# Altium schematic sheet 宁波2号线PIS_数字功率放大器_功放板(BHC-A-2030-01)_原理图_V1.0 (16).SchDoc
size 594 x 419 mm; SheetNumber: 0; SheetTotal: 0; PageSetup: Record=PageOptions|CenterHorizontal=True|CenterVertical=True|PrintScale=0.68|XCorrection=1.00|YCorrection=1.00|PrintKind=0|BorderSize=5000000|LeftOffset=0|BottomOffset=0|Orientation=2|PaperLength=4200|PaperWidth=2970|Scale=100|PaperSource=7|PrintQuality=-4|MediaType=1|DitherType=10|PaperKind=A3 297 x 420 毫米¦PrintScaleMode=1
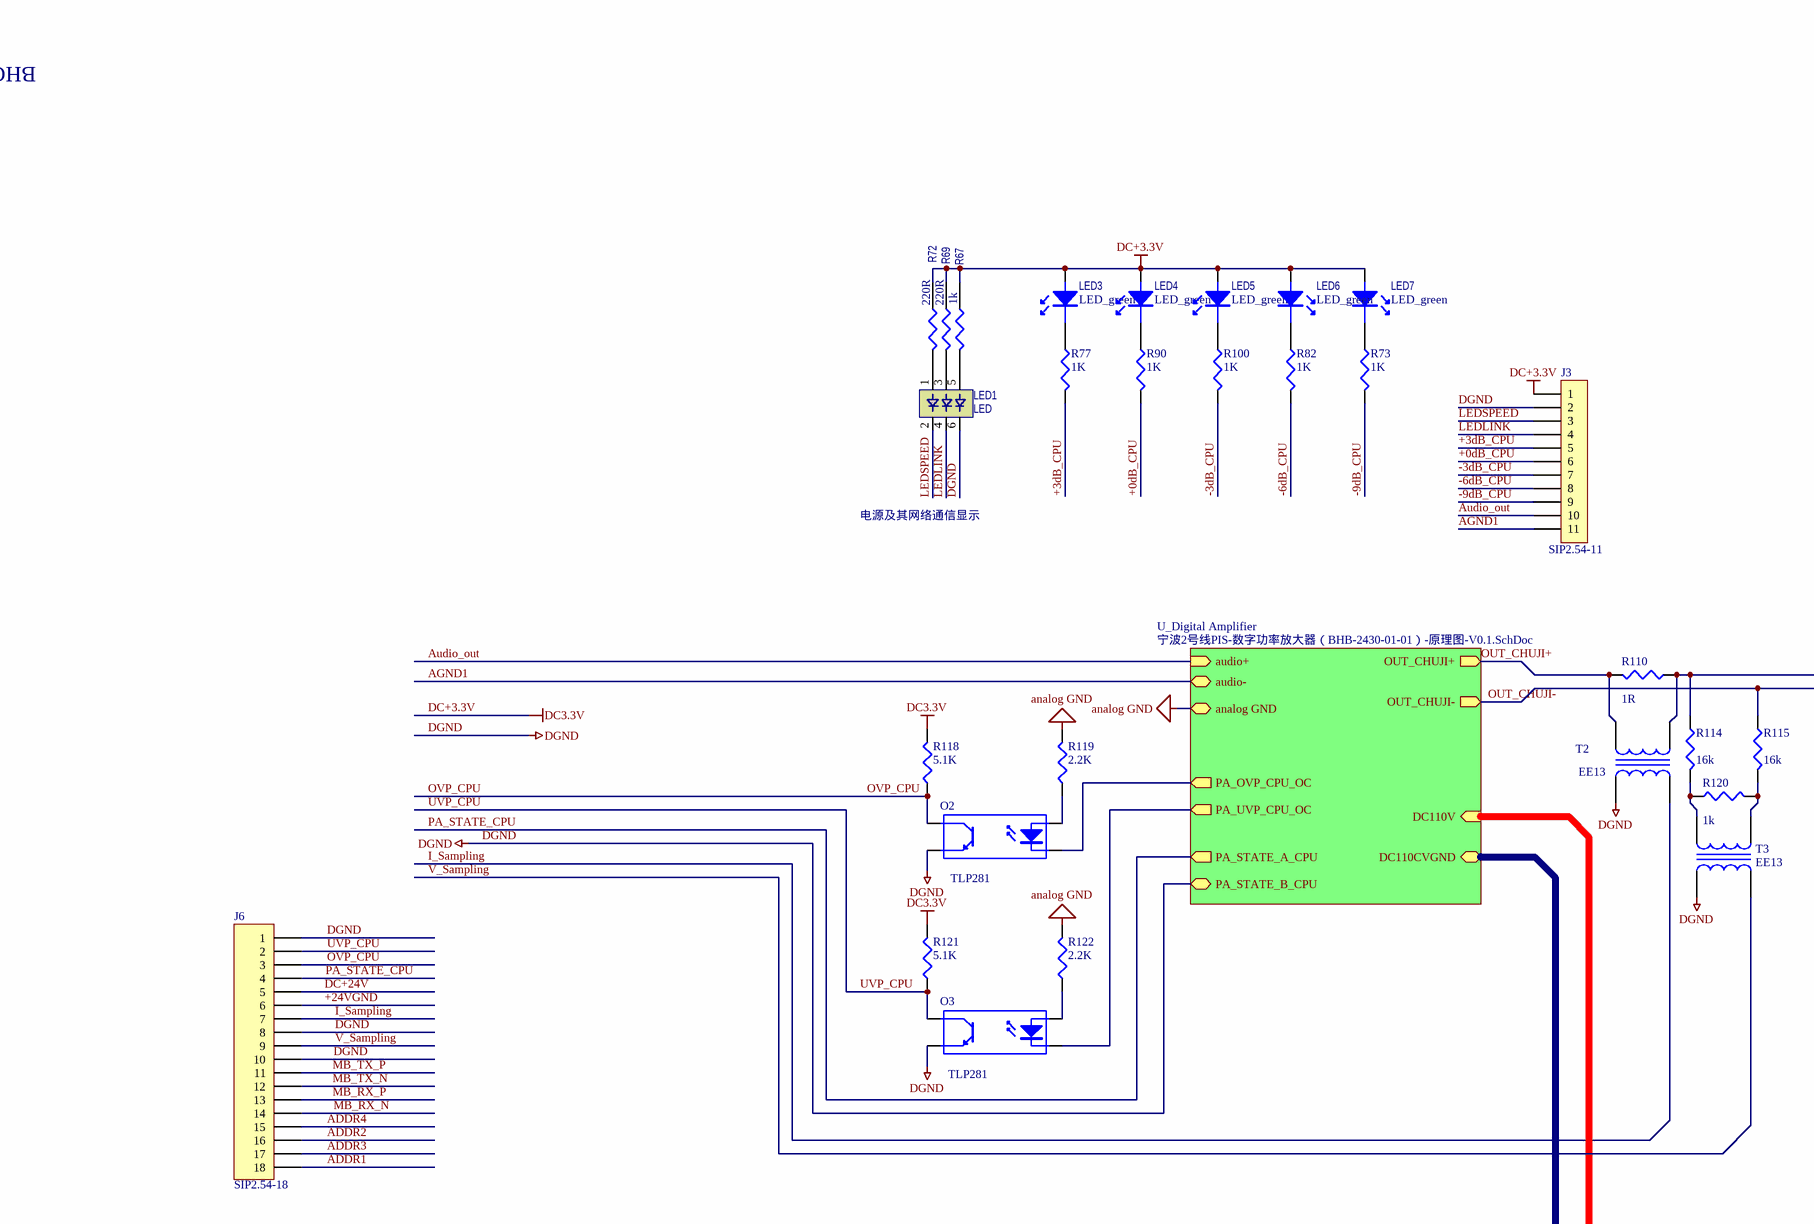
[diagram p0: 宁波2号线PIS_数字功率放大器_功放板(BHC-A-2030-01)_原理图_V1.0 (16).SchDoc, top left]
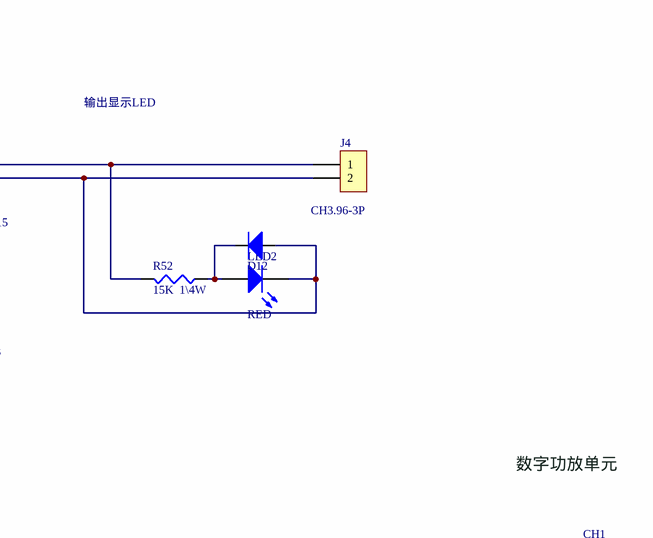
[diagram p1: 宁波2号线PIS_数字功率放大器_功放板(BHC-A-2030-01)_原理图_V1.0 (16).SchDoc, top right]
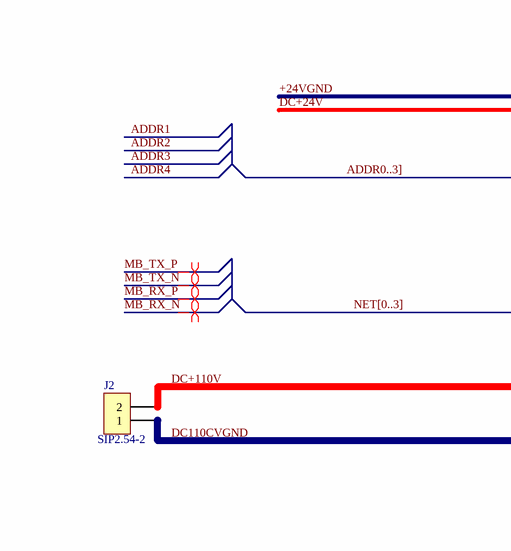
[diagram p2: 宁波2号线PIS_数字功率放大器_功放板(BHC-A-2030-01)_原理图_V1.0 (16).SchDoc, bottom left]
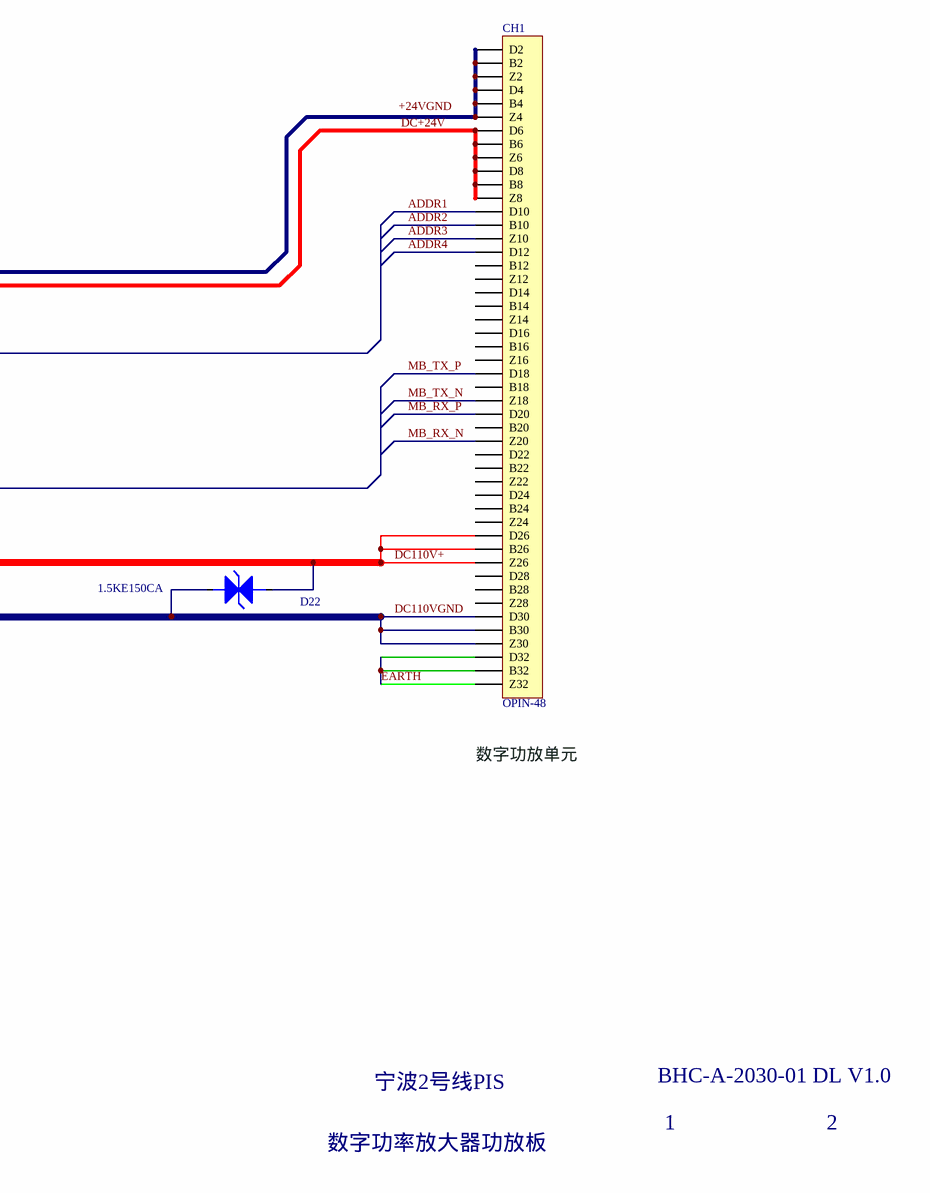
[diagram p3: 宁波2号线PIS_数字功率放大器_功放板(BHC-A-2030-01)_原理图_V1.0 (16).SchDoc, bottom right]

## Parts
CH1  OPIN-48  [OPIN-48f]
D12  DIODE  [7227AK]  (value not drawn)
D22  value 1.5KE150CA  [TVS-CA]  (hidden comment: D_TVS)
J2  value SIP2.54-2  [SIP2.54-2]  (hidden comment: CON2)
J3  value SIP2.54-11  [SIP2.54-11]  (hidden comment: CON11)
J4  value CH3.96-3P  [CH3.96-3P+]  (hidden comment: CON2)
J6  value SIP2.54-18  [SIP2.54-18]  (hidden comment: CON18)
LED1  LED  [LED-3-3-L]
LED2  RED  [LED-3-L]
LED3  value LED_green  [LED-3-L]
LED4  value LED_green  [LED-3-L]
LED5  value LED_green  [LED-3-L]
LED6  value LED_green  [LED-3-L]
LED7  value LED_green  [LED-3-L]
O2  TLP281  [SOP4]
O3  TLP281  [SOP4]
R52  value 15K  1\4W  [R-1/4W]
R67  value 1k  [M0805]
R69  value 220R  [M0805]
R72  value 220R  [M0805]
R73  value 1K  [M0805]  (hidden comment: 11k)
R77  value 1K  [M0805]  (hidden comment: 11k)
R82  value 1K  [M0805]  (hidden comment: 11k)
R90  value 1K  [M0805]  (hidden comment: 11k)
R100  value 1K  [M0805]  (hidden comment: 11k)
R110  value 1R  [R-2W]
R114  value 16k  [R-1/4W]
R115  value 16k  [R-1/4W]
R118  value 5.1K  [M0805]
R119  value 2.2K  [M0805]
R120  value 1k  [R-1/4W]
R121  value 5.1K  [M0805]
R122  value 2.2K  [M0805]
T2  EE13  [EE13-C]
T3  EE13  [EE13-C]

## Sub-sheets
U_Digital Amplifier = 宁波2号线PIS-数字功率放大器（BHB-2430-01-01）-原理图-V0.1.SchDoc: audio+ (in), OUT_CHUJI+ (out), OUT_CHUJI- (out), PA_STATE_A_CPU (out), PA_UVP_CPU_OC (out), PA_OVP_CPU_OC (out), DC110V (in), DC110CVGND (bidir), PA_STATE_B_CPU (bidir), audio- (bidir), analog GND (bidir)

## Nets
analog GND: R119.1 R122.1 ; sheet U_Digital Amplifier/analog GND
DC+3.3V: J3.1 LED3.1 LED4.1 LED5.1 LED6.1 LED7.1 R67.2 R69.2 R72.2 R118.1 R121.1  [also labelled DC3.3V]
DGND: J3.2 J6.1 J6.8 J6.10 LED1.6 O2.3(E) O3.3(E) T2.1 T3.1 ; sheet U_Digital Amplifier/PA_STATE_B_CPU
+0dB_CPU: J3.6 R90.2
+3dB_CPU: J3.5 R77.2
+24VGND: CH1.B2 CH1.B4 CH1.D2 CH1.D4 CH1.Z2 CH1.Z4 J6.6
-3dB_CPU: J3.7 R100.2
-6dB_CPU: J3.8 R82.1
-9dB_CPU: J3.9 R73.1
ADDR1: CH1.D10 J6.18
ADDR2: CH1.B10 J6.16
ADDR3: CH1.Z10 J6.17
ADDR4: CH1.D12 J6.15
AGND1: J3.11 ; sheet U_Digital Amplifier/audio-
Audio_out: J3.10 ; sheet U_Digital Amplifier/audio+
DC110CVGND: CH1.B30 CH1.D30 CH1.Z30 D22.2 J2.1 ; sheet U_Digital Amplifier/DC110CVGND  [also labelled DC110VGND]
DC+24V: CH1.B6 CH1.B8 CH1.D6 CH1.D8 CH1.Z6 CH1.Z8 J6.5
DC+110V: CH1.B26 CH1.D26 CH1.Z26 D22.1 J2.2 ; sheet U_Digital Amplifier/DC110V  [also labelled DC110V+]
EARTH: CH1.B32 CH1.D32 CH1.Z32
I_Sampling: J6.7 T2.2
LEDLINK: J3.4 LED1.4
LEDSPEED: J3.3 LED1.2
MB_RX_N: CH1.Z20 J6.14
MB_RX_P: CH1.D20 J6.13
MB_TX_N: CH1.Z18 J6.12
MB_TX_P: CH1.D18 J6.11
OUT_CHUJI+: R110.2 T2.5 ; sheet U_Digital Amplifier/OUT_CHUJI+
OUT_CHUJI-: D12.A J4.2 LED2.2(K) R115.1 ; sheet U_Digital Amplifier/OUT_CHUJI-
OVP_CPU: J6.3 O2.4(C) R118.2
PA_STATE_CPU: J6.4 ; sheet U_Digital Amplifier/PA_STATE_A_CPU
UVP_CPU: J6.2 O3.4(C) R121.2
V_Sampling: J6.9 T3.2
NetD12_K: D12.K LED2.1(A) R52.1
NetJ4_1: J4.1 R52.2 R110.1 R114.1 T2.3
NetLED1_1: LED1.1 R72.1
NetLED1_3: LED1.3 R69.1
NetLED1_5: LED1.5 R67.1
NetLED3_2: LED3.2 R77.1
NetLED4_2: LED4.2 R90.1
NetLED5_2: LED5.2 R100.1
NetLED6_2: LED6.2 R82.2
NetLED7_2: LED7.2 R73.2
NetO2_1: O2.1(A) R119.2
NetO2_2: O2.2(K) ; sheet U_Digital Amplifier/PA_OVP_CPU_OC
NetO3_1: O3.1(A) R122.2
NetO3_2: O3.2(K) ; sheet U_Digital Amplifier/PA_UVP_CPU_OC
NetR114_2: R114.2 R120.1 T3.5
NetR115_2: R115.2 R120.2 T3.3

Not connected (* = marked no-connect by the designer): CH1 B12 B14 B16 B18 B20 B22 B24 B28 D14 D16 D22 D24 D28 Z12 Z14 Z16 Z22 Z24 Z28; T2 4; T3 4

## Buses and harness runs
bus ADDR0..3]
bus NET[0..3]

## Layout directives
differential pair: MB_RX_N, MB_RX_P, MB_TX_N, MB_TX_P

## Notes on the sheet
- BHC-A-2030-01 DL V1.0
- 电源及其网络通信显示
- 输出显示LED
- 数字功放单元
- 宁波2号线PIS
- 数字功率放大器功放板
- 1
- 2
- Labels drawn without touching a wire or pin: +24VGND
- 媒体编号
- 旧底图总号
- 更改
- 标记
- 数量
- 更改单号
- 签 名
- 日期
- 底图总号
- 拟  制
- 审  核
- 标准化
- 第      张
- 天津市北海通信技术有限公司
- 共      张
- 格式
- (3)
- 制图
- 批  准
- ：
- 描图
- 图幅

## Library data of the parts
D12 = DIODE: Default Diode; Text Field6: Published 8-Jun-2000
J2 J4 = CON2: Connector
J6 = CON18: Connector
LED1 = 3-LED
LED2 = LED2: Typical RED, GREEN, YELLOW, AMBER GaAs LED; Published: 8-Jun-2000; LatestRevisionDate: 17-Jul-2002; LatestRevisionNote: Re-released for DXP Platform.; PackageVersion: Feb-2002; PackageReference: 3.2X1.6X1.1; Publisher: Altium Limited; PackageDescription: SM LED; 2 Flat Leads; Value: RED
LED3-LED7 = LED
O2 O3 = Optoisolator1: 4-Pin Phototransistor Optocoupler; Published: 24-Mar-1999; LatestRevisionDate: 04-Mar-2005; LatestRevisionNote: Sch pins 3 & 4 Swapped.; DatasheetVersion: Nov-2003; PackageReference: DIP-4; Publisher: Altium Limited; Value: TLP281
R52 R73 R77 R82 R90 R100 R110 R114 R115 R118-R122 = Res3: Resistor; Published: 8-Jun-2000; LatestRevisionDate: 29-May-2009; LatestRevisionNote: IPC-7351 Footprint Added.; Publisher: Altium Limited; PackageDescription: Chip Resistor
  R52 R110 R114 R115 R118-R122: PackageReference: J1-0603
  R73 R77 R82 R90 R100: PackageReference: M0805
R67 R69 R72 = RES1
T2 T3 = EE13: Value: EE13